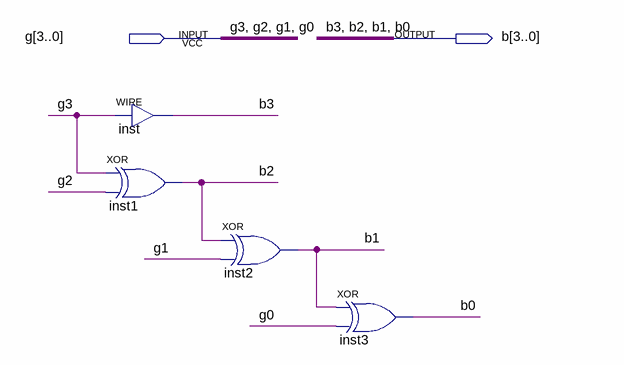
[diagram p0: schematic sheet]
// Quartus schematic s34_gray_to_bin.bdf as structural Verilog: 4 symbols, 2 pins
module s34_gray_to_bin (
  input  [3:0] g,
  output [3:0] b
);

  assign b[3] = g[3];  // WIRE inst
  xor inst1 (b[2], g[3], g[2]);
  xor inst2 (b[1], b[2], g[1]);
  xor inst3 (b[0], b[1], g[0]);
endmodule
